# EAGLE design Daughter Board (EAGLE 9.6.2)
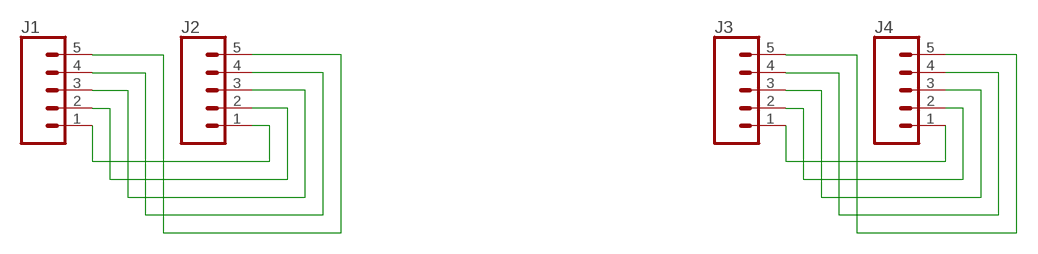
[diagram p0: schematic, sheet 1]

## Parts
J1  CONN_05  [1X05]
J2  CONN_05  [1X05]
J3  CONN_05  [1X05]
J4  CONN_05  [1X05]

## Nets
N$1: J1.1 J2.1
N$2: J1.2 J2.2
N$3: J1.3 J2.3
N$4: J1.4 J2.4
N$5: J1.5 J2.5
N$6: J3.1 J4.1
N$7: J3.2 J4.2
N$8: J3.3 J4.3
N$9: J3.4 J4.4
N$10: J3.5 J4.5

## Library data of the parts
J1-J4 = SparkFun-Connectors:CONN_05: Multi connection point. Often used as Generic Header-pin footprint for 0.1 inch spaced/style header connections On any of the 0.1 inch spaced packages, you can populate with these: Break Away Headers - Straight <https://www.sparkfun.com/products/116> (PRT-00116) Break Away Male Headers - Right Angle <https://www.sparkfun.com/products/553> (PRT-00553) Female Headers <https://www.sparkfun.com/products/115> (PRT-00115) Break Away Headers - Machine Pin <https://www.sparkfun.com/products/117> (PRT-00117) Break Away Female Headers - Swiss Machine Pin <https://www.sparkfun.com/products/743> (PRT-00743) For SCREWTERMINALS and SPRING TERMINALS visit here: Screw Terimnals on SparkFun.com <https://www.sparkfun.com/search/results?term=Screw+Terminals> (5mm/3.5mm/2.54mm spacing) This device is also useful as a general connection point to wire up your design to another part of your project. Our various solder wires solder well into these plated through hole pads. Hook-Up Wire - Assortment (Stranded, 22 AWG) <https://www.sparkfun.com/products/11375> (PRT-11375) Hook-Up Wire - Assortment (Solid Core, 22 AWG) <https://www.sparkfun.com/products/11367> (PRT-11367) View the entire wire category on our website here <https://www.sparkfun.com/categories/141> Special notes: Molex polarized connector foot print use with SKU : PRT-08231 with associated crimp pins and housings. 1MM SMD Version SKU: PRT-10208

## Net classes
0 default: width 0.254 mm, drill 0.254 mm, clearance 0.254 mm

## Board
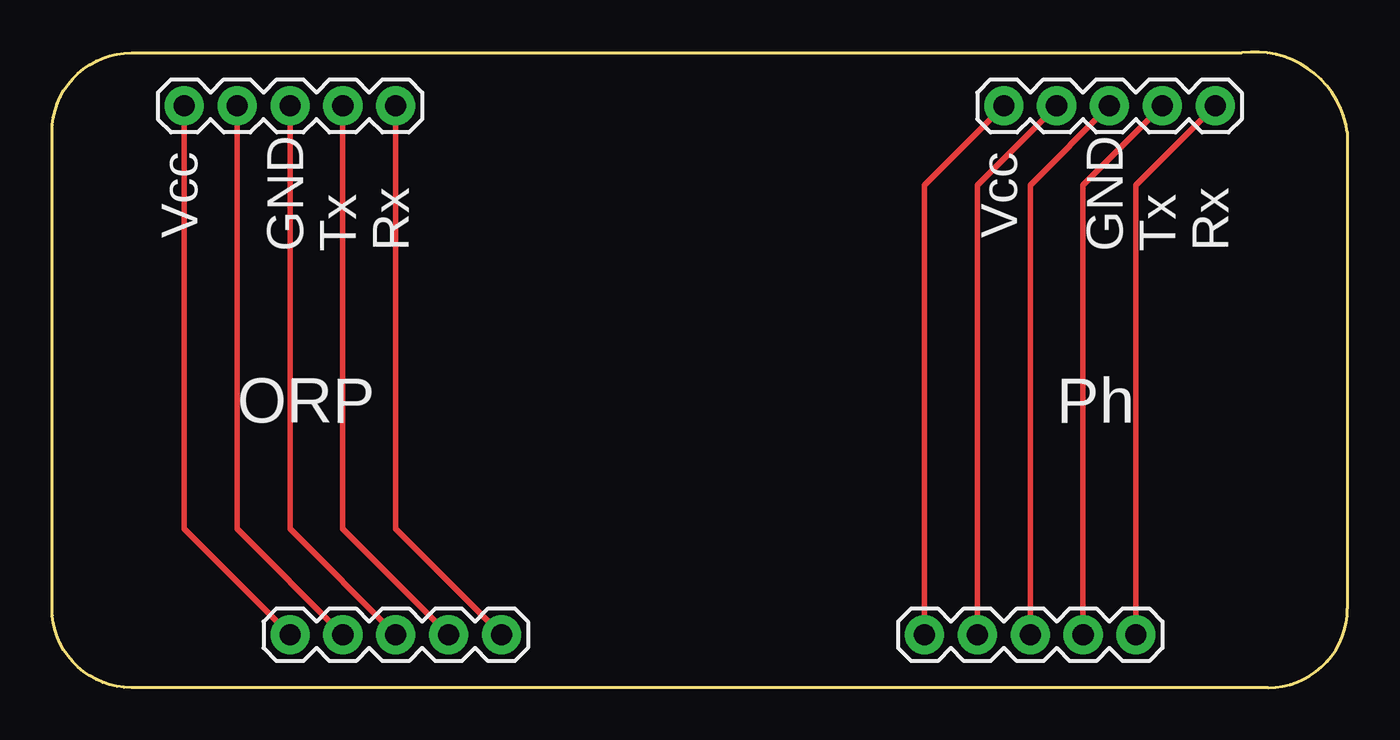
[diagram p1: board, top side]

Size 62.23 x 30.52 mm. Coordinates in mm from the lower left corner, seen from the top.
Outline: 3.81,30.48 57.15,30.48 arc-90 62.23,26.67 62.23,3.81 arc-90 58.42,0 3.81,0 arc-90 0,3.81 0,26.67 arc-90 3.81,30.48
Copper layers (1*16): Top 0.035mm / dielectric 1.5mm / Bottom 0.035mm
Design rules "default": minimum track width 6mil, minimum drill 0.35mm, track to track 6mil, track to pad 6mil, pad to pad 6mil, via to via 6mil, smd to smd 6mil, copper to edge 40mil, drill to drill 6mil, minimum pad ring 10mil, minimum via ring 8mil, stop-mask expansion 4mil, vias tented up to drill 0mil, thermal gap 10mil

### Footprints (pad centres in the part's own frame; a part is rotated, then mirrored left to right if it is on the bottom)
1X05 = drill 1.016 pad 1.88: 1 0,0; 2 2.54,0; 3 5.08,0; 4 7.62,0; 5 10.16,0

### Placement (x,y rotation side)
J1  11.43,2.54 0 top
J2  6.35,27.94 0 top
J3  41.91,2.54 0 top
J4  45.72,27.94 0 top

### Tracks (layer width: path | path; a pad name or v marks a point on that pad's centre or on a via)
N$1
  Top 0.254: J2.1 6.35,7.62 J1.1
N$2
  Top 0.254: J2.2 8.89,7.62 J1.2
N$3
  Top 0.254: J2.3 11.43,7.62 J1.3
N$4
  Top 0.254: J2.4 13.97,7.62 J1.4
N$5
  Top 0.254: J2.5 16.51,7.62 J1.5
N$6
  Top 0.254: J3.1 41.91,24.13 J4.1
N$7
  Top 0.254: J3.2 44.45,24.13 J4.2
N$8
  Top 0.254: J3.3 46.99,24.13 J4.3
N$9
  Top 0.254: J3.4 49.53,24.13 J4.4
N$10
  Top 0.254: J3.5 52.07,24.13 J4.5

### Text on the board
tPlace: Vcc | Vcc | GND | Tx | Rx | GND | Tx | Rx | ORP | Ph